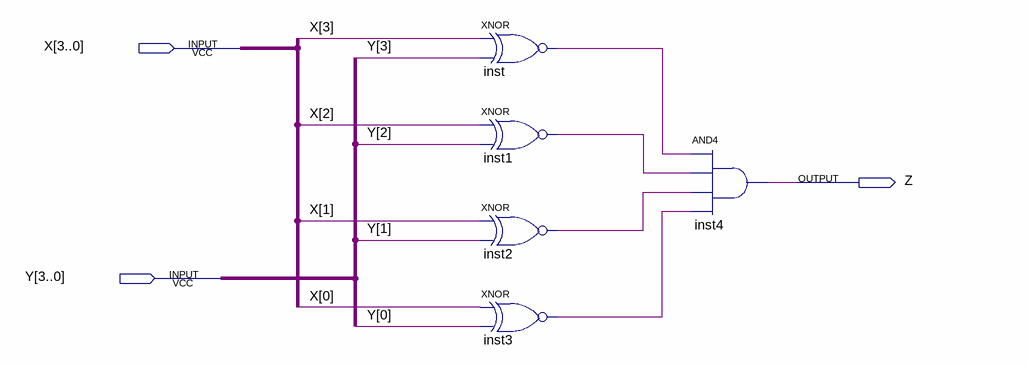
[diagram p0: schematic sheet]
// Quartus schematic comparator4bit.bdf as structural Verilog: 5 symbols, 3 pins
module comparator4bit (
  input  [3:0] X,
  input  [3:0] Y,
  output Z
);

  wire inst1_out, inst2_out, inst3_out, inst_out;

  xnor inst (inst_out, X[3], Y[3]);
  xnor inst1 (inst1_out, X[2], Y[2]);
  xnor inst2 (inst2_out, X[1], Y[1]);
  xnor inst3 (inst3_out, X[0], Y[0]);
  and inst4 (Z, inst_out, inst1_out, inst2_out, inst3_out);
endmodule
